# EAGLE design ZeroCrossSimple (EAGLE 7.2.0)
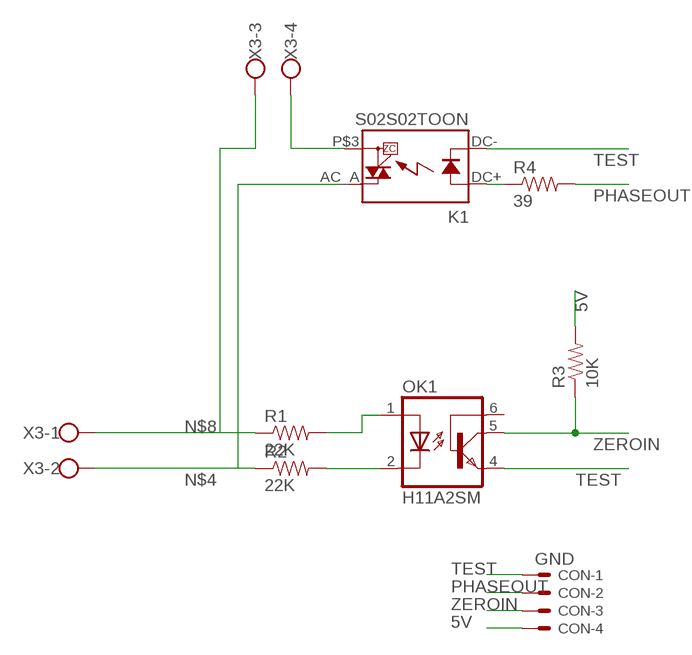
[diagram p0: schematic, sheet 1]

## Parts
CON  GND  KK-156-4  [KK-156-4]
K1  S02S02TOON  [TOON]
OK1  H11A2SM  [DIL6-SMD]
R1  22K  RESISTOR2512  [R2512]
R2  22K  RESISTOR2512  [R2512]
R3  10K  RESISTOR0805-RES  [0805]
R4  39  RESISTOR0805-RES  [0805]
X3  W237-4  [W237-4]

## Nets
5V: CON.4 R3.2
N$1: OK1.1(A) R1.2
N$2: OK1.2(C) R2.2
N$3: K1.P$3(DS2) X3.4
N$4: K1.AC_A(DS1) R2.1 X3.2
N$5: K1.DC+(A) R4.1
N$8: R1.1 X3.1 X3.3
PHASEOUT: CON.2 R4.2
TEST: CON.1 K1.DC-(K) OK1.4(EMI)
ZEROIN: CON.3 OK1.5(COL) R3.1
Unconnected: OK1.6(BAS)

## Library data of the parts
CON = con-molex:KK-156-4: KK 156 HEADER Source: http://www.molex.com/pdm_docs/sd/026604100_sd.pdf; OC_FARNELL: unknown; OC_NEWARK: unknown
K1 = relay:S*02S02: IT(rms) 8A, Zero Cross type SIP 4pin Triac output SSR Source: http://sharp-world.com/products/device/lineup/data/pdf/datasheet/s102s02_e.pdf
OK1 = optocoupler:H11A*?M: General Purpose 6-Pin Phototransistor Optocouplers Source: http://www.fairchildsemi.com/ds/4N/4N35-M.pdf; OC_FARNELL: unknown; OC_NEWARK: unknown
R1-R3 = SparkFun-Passives:RESISTOR: Resistor Basic schematic elements and footprints for 0603, 1206, and PTH resistors.
R4 = SparkFun-Resistors:RESISTOR: Resistor Basic schematic elements and footprints for 0603, 1206, and PTH resistors.
X3 = con-wago-500:W237-4: WAGO SCREW CLAMP; OC_FARNELL: unknown; OC_NEWARK: unknown

## Board
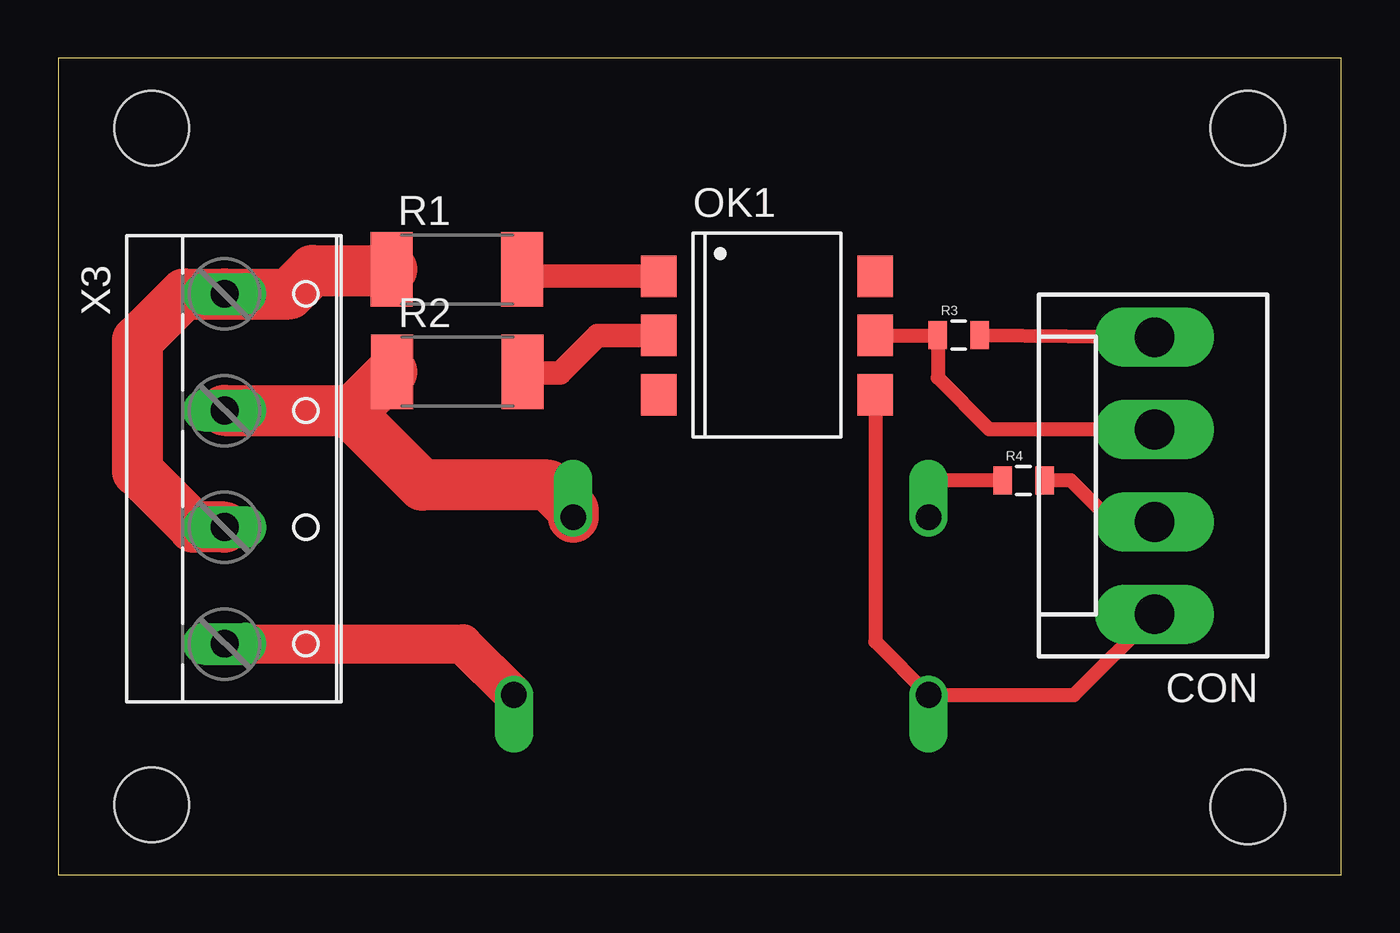
[diagram p1: board, top side]

Size 55 x 35 mm. Coordinates in mm from the lower left corner, seen from the top.
Outline: 0,0 55,0 55,35 0,35 0,0
Copper layers (1*16): Top 0.035mm / dielectric 1.5mm / Bottom 0.035mm
Design rules "ZeroCrossSimple": minimum track width 10mil, minimum drill 24mil, track to track 0.205mm, track to pad 0.205mm, pad to pad 0.205mm, via to via 0.205mm, smd to smd 8mil, copper to edge 40mil, drill to drill 8mil, minimum pad ring 10mil, minimum via ring 8mil, stop-mask expansion 4mil, vias tented up to drill 0mil, thermal gap 10mil
Holes 3.2 mm at 4,3 51,2.9 4,32 51,32

### Footprints (pad centres in the part's own frame; a part is rotated, then mirrored left to right if it is on the bottom)
KK-156-4 = drill 1.7 pad 2.184 long: 1 -5.94,0; 2 -1.98,0; 3 1.98,0; 4 5.94,0
TOON = drill 1.1 offset: AC_A 15.24,0; DC+ 0,0; DC- 0,-7.62; P$3 17.78,-7.62
DIL6-SMD = smd 1.78 x 1.52: 1 -2.54,-4.645; 2 0,-4.645; 3 2.54,-4.645; 4 2.54,4.645; 5 0,4.645; 6 -2.54,4.645
R2512 = smd 1.8 x 3.2: 1 -2.8,0; 2 2.8,0
0805 = smd 0.8 x 1.2: 1 -0.9,0; 2 0.9,0
W237-4 = drill 1.194 long: 1 -7.5,-1.27; 2 -2.5,-1.27; 3 2.5,-1.27; 4 7.5,-1.27

### Placement (x,y rotation side)
CON  47,17.1 90 top
K1  37.31,15.32 0 bottom
OK1  30.38,23.12 270 top
R1  17.09,25.94 0 top
R2  17.11,21.56 0 top
R3  38.6,23.14 0 top
R4  41.38,16.91 0 top
X3  8.4,17.4 270 top

### Tracks (layer width: path | path; a pad name or v marks a point on that pad's centre or on a via)
5V
  Top 0.61: R3.2 CON.4
N$1
  Top 1.016: OK1.1 20.18,25.66 R1.2
N$2
  Top 1.016: OK1.2 23.12,23.12 21.5,21.5 19.97,21.5 R2.2
N$3
  Top 1.676: X3.4 17.33,9.9 K1.P$3
N$4
  Top 2.184: X3.2 12.4,19.9 | 12.4,19.9 12.65,19.9 R2.1 | K1.AC_A 22.07,15.63 21,16.7 15.6,16.7 12.4,19.9
N$5
  Top 0.61: R4.1 37.3,16.91 37.3,16.9 37.3,15.33 K1.DC+
N$8
  Top 2.184: X3.3 5.8,14.9 3.4,17.3 3.4,22.9 5.4,24.9 X3.1 9.9,24.9 10.9,25.9 14.25,25.9 R1.1
PHASEOUT
  Top 0.61: CON.2 45.18,15.12 43.4,16.9 R4.2
TEST
  Top 0.61: OK1.4 35.02,9.99 K1.DC- 43.54,7.7 CON.1
ZEROIN
  Top 0.61: OK1.5 37.68,23.12 R3.1 37.7,21.3 39.9,19.1 44.72,19.1 CON.3